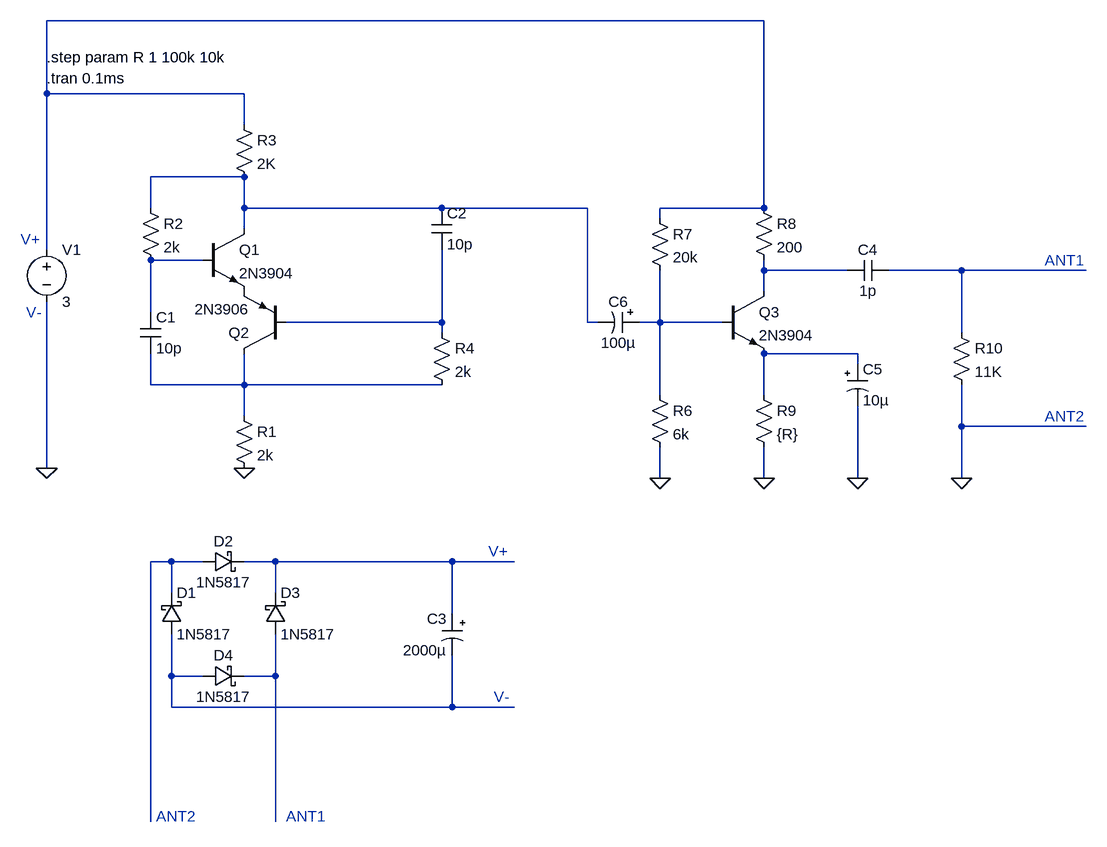
[diagram p0: schematic FoodTag_AM_Transmitter.asc]
FoodTag_AM_Transmitter.asc, the LTspice schematic file:
Version 4
SHEET 1 952 1064
WIRE 224 -240 -880 -240
WIRE -880 -128 -880 -240
WIRE -576 -128 -880 -128
WIRE -576 -80 -576 -128
WIRE -576 0 -720 0
WIRE -720 48 -720 0
WIRE -576 48 -576 0
WIRE -272 48 -576 48
WIRE -48 48 -272 48
WIRE 224 48 224 -240
WIRE 224 48 64 48
WIRE 64 64 64 48
WIRE -576 80 -576 48
WIRE -880 112 -880 -128
WIRE -640 128 -720 128
WIRE 224 144 224 128
WIRE 352 144 224 144
WIRE 528 144 416 144
WIRE 720 144 528 144
WIRE 224 176 224 144
WIRE -720 208 -720 128
WIRE -272 224 -272 112
WIRE -272 224 -512 224
WIRE -48 224 -48 48
WIRE -32 224 -48 224
WIRE 64 224 64 144
WIRE 64 224 32 224
WIRE 160 224 64 224
WIRE -272 240 -272 224
WIRE 528 240 528 144
WIRE 368 272 224 272
WIRE 368 288 368 272
WIRE -720 320 -720 272
WIRE -576 320 -576 272
WIRE -576 320 -720 320
WIRE -272 320 -576 320
WIRE 64 336 64 224
WIRE 224 336 224 272
WIRE -576 368 -576 320
WIRE 528 384 528 320
WIRE 720 384 528 384
WIRE -880 448 -880 192
WIRE 64 464 64 416
WIRE 224 464 224 416
WIRE 368 464 368 352
WIRE 528 464 528 384
WIRE -688 592 -720 592
WIRE -640 592 -688 592
WIRE -528 592 -576 592
WIRE -256 592 -528 592
WIRE -160 592 -256 592
WIRE -688 640 -688 592
WIRE -528 640 -528 592
WIRE -256 672 -256 592
WIRE -688 768 -688 704
WIRE -640 768 -688 768
WIRE -528 768 -528 704
WIRE -528 768 -576 768
WIRE -688 816 -688 768
WIRE -256 816 -256 736
WIRE -256 816 -688 816
WIRE -160 816 -256 816
WIRE -720 992 -720 592
WIRE -528 992 -528 768
FLAG -880 448 0
FLAG 64 464 0
FLAG 224 464 0
FLAG 368 464 0
FLAG 528 464 0
FLAG -576 448 0
SYMBOL voltage -880 96 R0
WINDOW 123 0 0 Left 0
WINDOW 39 24 124 Left 2
SYMATTR InstName V1
SYMATTR Value 3
SYMBOL res -592 352 R0
SYMATTR InstName R1
SYMATTR Value 2k
SYMBOL res -736 32 R0
SYMATTR InstName R2
SYMATTR Value 2k
SYMBOL res -592 -96 R0
SYMATTR InstName R3
SYMATTR Value 2K
SYMBOL res -288 224 R0
SYMATTR InstName R4
SYMATTR Value 2k
SYMBOL cap -736 208 R0
SYMATTR InstName C1
SYMATTR Value 10p
SYMBOL cap -288 48 R0
SYMATTR InstName C2
SYMATTR Value 10p
SYMBOL npn -640 80 R0
SYMATTR InstName Q1
SYMATTR Value 2N3904
SYMBOL pnp -512 272 R180
SYMATTR InstName Q2
SYMATTR Value 2N3906
SYMBOL npn 160 176 R0
SYMATTR InstName Q3
SYMATTR Value 2N3904
SYMBOL res 48 320 R0
SYMATTR InstName R6
SYMATTR Value 6k
SYMBOL res 48 48 R0
SYMATTR InstName R7
SYMATTR Value 20k
SYMBOL res 208 32 R0
SYMATTR InstName R8
SYMATTR Value 200
SYMBOL res 208 320 R0
SYMATTR InstName R9
SYMATTR Value {R}
SYMBOL res 512 224 R0
SYMATTR InstName R10
SYMATTR Value 11K
SYMBOL polcap 32 208 R90
WINDOW 0 0 32 VBottom 2
WINDOW 3 32 32 VTop 2
SYMATTR InstName C6
SYMATTR Value 100µ
SYMBOL polcap 352 288 R0
SYMATTR InstName C5
SYMATTR Value 10µ
SYMBOL cap 416 128 R90
WINDOW 0 0 32 VBottom 2
WINDOW 3 32 32 VTop 2
SYMATTR InstName C4
SYMATTR Value 1p
SYMBOL schottky -704 704 M180
WINDOW 0 24 64 Left 2
WINDOW 3 24 0 Left 2
SYMATTR InstName D1
SYMATTR Value 1N5817
SYMBOL schottky -640 576 M90
WINDOW 0 0 32 VBottom 2
WINDOW 3 32 32 VTop 2
SYMATTR InstName D2
SYMATTR Value 1N5817
SYMBOL schottky -544 704 M180
WINDOW 0 24 64 Left 2
WINDOW 3 24 0 Left 2
SYMATTR InstName D3
SYMATTR Value 1N5817
SYMBOL schottky -640 752 M90
WINDOW 0 0 32 VBottom 2
WINDOW 3 32 32 VTop 2
SYMATTR InstName D4
SYMATTR Value 1N5817
SYMBOL polcap -240 672 M0
SYMATTR InstName C3
SYMATTR Value 2000µ
TEXT -880 -152 Left 2 !.tran 0.1ms
TEXT -880 -184 Left 2 !.step param R 1 100k 10k
TEXT 656 128 Left 2 ;ANT1
TEXT 656 368 Left 2 ;ANT2
TEXT -512 984 Left 2 ;ANT1
TEXT -712 984 Left 2 ;ANT2
TEXT -200 576 Left 2 ;V+
TEXT -192 800 Left 2 ;V-
TEXT -920 96 Left 2 ;V+
TEXT -912 208 Left 2 ;V-

The netlist it stands for:
* FoodTag_AM_Transmitter.asc
V1 N001 0 3
R1 N009 0 2k
R2 N002 N003 2k
R3 N001 N002 2K
R4 N006 N009 2k
C1 N003 N009 10p
C2 N002 N006 10p
Q1 N002 N003 P001 0 2N3904
Q2 N009 N006 P001 0 2N3906
Q3 N004 N007 N008 0 2N3904
R6 N007 0 6k
R7 N001 N007 20k
R8 N001 N004 200
R9 N008 0 {R}
R10 N005 0 11K
C6 N007 N002 100µ
C5 N008 0 10µ
C4 N005 N004 1p
D1 N012 N010 1N5817
D2 N010 N011 1N5817
D3 N013 N011 1N5817
D4 N012 N013 1N5817
C3 N011 N012 2000µ
.model D D
.lib standard.dio
.model NPN NPN
.model PNP PNP
.lib standard.bjt
.tran 0.1ms
.step param R 1 100k 10k
* ANT1
* ANT2
* ANT1
* ANT2
* V+
* V-
* V+
* V-
.backanno
.end